# Altium schematic sheet SPI.SchDoc
size A4
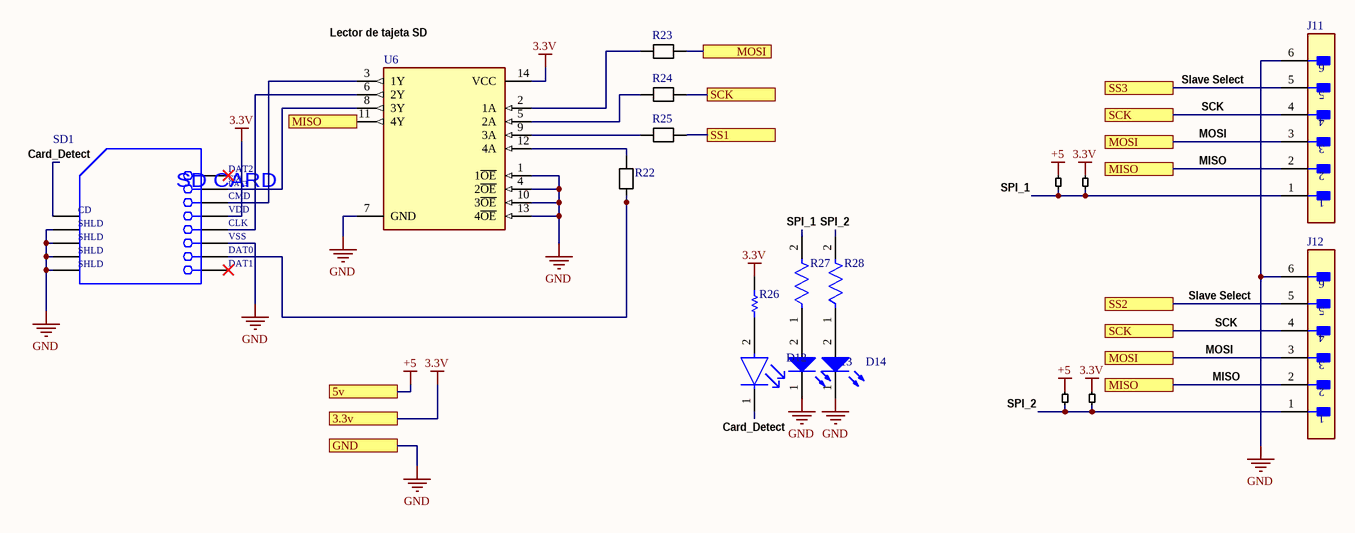
[diagram p0: SPI.SchDoc]

## Parts
D12  LTST-C170KFKT  [FP-LTST-C170KFKT-MFG]  (value not drawn)
D13  150080BS75000  [WL-SMCW_0805_150080xx75000]  (value not drawn)
D14  150080BS75000  [WL-SMCW_0805_150080xx75000]  (value not drawn)
J11  B6B-XH-A(LF)(SN)  [FP-B6B-XH-A_LF_SN-MFG]  (value not drawn)
J12  B6B-XH-A(LF)(SN)  [FP-B6B-XH-A_LF_SN-MFG]  (value not drawn)
R22  3k3  [1206]  (value not drawn)
R23  3k3  [1206]  (value not drawn)
R24  3k3  [1206]  (value not drawn)
R25  3k3  [1206]  (value not drawn)
R26  ERJ6ENF6800V  [RESC2013X70X40ML20T20]  (value not drawn)
R27  ERJ-P06F1001V  [FP-ERJP06-MFG]  (value not drawn)
R28  ERJ-P06F1001V  [FP-ERJP06-MFG]  (value not drawn)
SD1  473521001  [MOLX-473521001_V]  (value not drawn)
U6  SN74LVC125APWR  [FP-PW0014A-IPC_B]  (value not drawn)
W21  Jumper  [Jumper Mid]  (value not drawn)
W22  Jumper  [Jumper Mid]  (value not drawn)
W23  Jumper  [Jumper Mid]  (value not drawn)
W24  Jumper  [Jumper Mid]  (value not drawn)

## Ports
3.3v, 5v, GND, MISO, MOSI, SCK, SS1, SS2, SS3

## Nets
3.3V: R26.2 SD1.4(VDD) U6.14(VCC) W23.2 W24.2 ; port 3.3v
+5: W21.2 W22.2 ; port 5v
GND: D13.1(K) D14.1(K) J11.6 J12.6 SD1.6(VSS) SD1.10(SHLD) SD1.11(SHLD) SD1.12(SHLD) SD1.13(SHLD) U6.1(1~{OE}) U6.4(2~{OE}) U6.7(GND) U6.10(3~{OE}) U6.13(4~{OE}) ; port GND
Card_Detect: D12.1(C) SD1.9(CD)
MISO: J11.2 J12.2 U6.11(4Y) ; port MISO
MOSI: J11.3 J12.3 R23.2 ; port MOSI
SCK: J11.4 J12.4 R24.2 ; port SCK
SPI_1: J11.1 R27.2 W21.1 W23.1
SPI_2: J12.1 R28.2 W22.1 W24.1
SS1: R25.2 ; port SS1
SS2: J12.5 ; port SS2
SS3: J11.5 ; port SS3
NetD12_2: D12.2(A) R26.1
NetD13_2: D13.2(A) R27.1
NetD14_2: D14.2(A) R28.1
NetR22_1: R22.1 U6.12(4A)
NetR22_2: R22.2 SD1.7(DAT0)
NetR23_1: R23.1 U6.2(1A)
NetR24_1: R24.1 U6.5(2A)
NetR25_1: R25.1 U6.9(3A)
NetSD1_2: SD1.2(CD/DAT3) U6.8(3Y)
NetSD1_3: SD1.3(CMD) U6.3(1Y)
NetSD1_5: SD1.5(CLK) U6.6(2Y)

Not connected (* = marked no-connect by the designer): SD1 1(DAT2)* 8(DAT1)*

## Notes on the sheet
- (near U6) Lector de tajeta SD
- Slave Select
- SCK
- MOSI
- MISO
- (near J12) Slave Select
- (in symbol CMP-2000-05848-1) CD/; DAT3; SD CARD

## Library data of the parts
D12 = CMP-22017-000036-1: LED ORANGE CLEAR SMD; Forward Current: 30mA; Reverse Voltage: 5V; Forward Voltage: 2V; Lens Style: Diffused; Number of Elements: 1; Test Current: 20mA; Lens Color: Colorless; Viewing Angle: 130°; Dominant Wavelength: 605nm; Luminous Intensity: 60mcd; Power Rating: 75mW; Wavelength: 611nm; Min Operating Temperature: -55°C; Packaging: Tape and Reel; Case Code (Metric): 2012; Depth: 1.6mm; Case Code (Imperial): 0805; Mount: Surface Mount; Radiation Hardening: No; Lens Transparency: Clear; Color: Orange; Package Quantity: 1; Illumination Color: Orange; Lead Free: Lead Free; Number of LEDs: 1; Length: 3.2mm; Height: 1.1mm; Number of Pins: 2; Width: 1.25mm; Case/Package: 0805; Power Dissipation: 75mW; Max Operating Temperature: 85°C
D13 D14 = CMP-1426-00008-6: NexarPartId: 29717779; Test Current: 20mA; Lens Style: Clear, Rectangular; Forward Current: 100mA; Power Dissipation: 105mW; Dominant Wavelength: 470nm; Reverse Voltage: 5V; Viewing Angle: 140°; Luminous Intensity: 145mcd; Color: Blue; Forward Voltage: 3.2V; Max Junction Temperature (Tj): 95°C; Peak Wavelength: 465nm; Min Operating Temperature: -40°C; Mount: Surface Mount; Case Code (Imperial): 0805; Packaging: Tape and Reel; Lead Free: Lead Free; Length: 2mm; Case/Package: 0805; Case Code (Metric): 2012; Max Operating Temperature: 85°C; Height: 700µm; RoHS: Compliant; Max Reverse Voltage (DC): 5V; REACH SVHC: Unknown; Width: 1.25mm; Wavelength: 470nm
J11 J12 = CMP-17439-000076-1: CONN HEADER VERT 6POS 2.5MM
R22-R25 = RGC1206DTC10K0: Package: None; Price: None; Value: *; MP: RGC1206DTC10K0; Availability: Unavailable
R26 = CMP-2001-00566-1: Manufacturer: Panasonic; Part Number: ERJ6ENF6800V
R27 R28 = CMP-05422-000125-1: RES SMD 1K OHM 1% 1/2W 0805; Temperature Coefficient: 100ppm/°C; Max Power Dissipation: 500mW; Voltage Rating: 150V; Resistance: 1kR; Case Code (Metric): 2012; Max Operating Temperature: 155°C; REACH SVHC: No SVHC; Mount: Surface Mount; Military Standard: Not; Package Quantity: 5000; Series: ERJ; Height: 0.6mm; Radiation Hardening: No; Termination: Tab; Number of Terminations: 2; Length: 2mm; Resistance Tolerance: 1%; Voltage Rating (DC): 150V; Depth: 1.25mm; Construction: Rectangular; Resistor Type: Thick Film; Packaging: Tape and Reel; Contact Plating: Tin; RoHS Compliant: Yes; Features: Automotive AEC-Q200; Number of Pins: 2; Case Code (Imperial): 0805; Technology: THICK FILM; Width: 1.2mm; Case/Package: 0805; Min Operating Temperature: -55°C; Power Rating: 500mW; Tolerance: 1%
SD1 = CMP-2000-05848-1: MicroSD(TM), Pitch 1.1 mm, 8 Position, Height 1.88 mm, -20 to 85 degC, RoHS, Tape and Reel; Manufacturer: Molex; Datasheet Version: Rev. G, 01/2012; Datasheet URL: http://www.molex.com/pdm_docs/sd/473521001_sd.pdf; Package Reference: 473521001; Manufacturer URL: http://www.molex.com/; Mounting Technology: SurfaceMount; Package Description: MicroSD(TM), Pitch 1.1 mm, 8 Position, Height 1.88 mm
U6 = CMP-0440-00179-4: IC BUF NON-INVERT 3.6V 14TSSOP; Max Power Dissipation: 500mW; Number of Bits per Element: 1; Number of Bits: 4; Quiescent Current: 1uA; Min Supply Voltage: 1.65V; Propagation Delay: 4.6ns; High Level Output Current: -24mA; Logic Function: Buffer; Low Level Output Current: 24mA; Polarity: Non-Inverting; Turn-On Delay Time: 5.3ns; Number of Output Lines: 3; Mount: Surface Mount; Lead Free: Lead Free; Number of Outputs: 4; Max Supply Voltage: 3.6V; Packaging: Tape and Reel; Radiation Hardening: No; Number of Channels: 4; REACH SVHC: No SVHC; Length: 5mm; Number of Elements: 4; Contact Plating: Gold; Case/Package: TSSOP; Number of Input Lines: 4; Number of Inputs: 4; Height: 1.15mm; Number of Circuits: 4; Termination: SMD/SMT; Min Operating Temperature: -40°C; Package Quantity: 1; Number of Gates: 4; Max Operating Temperature: 125°C; Width: 4.4mm; Number of Pins: 14